# EasyEDA schematic Main Controller Design.json
TITLE: Main Controller; REV: 1.0; Date: 2019-12-06; Sheet: 1/1; Drawn By: mohitingale5; Company: SJSU
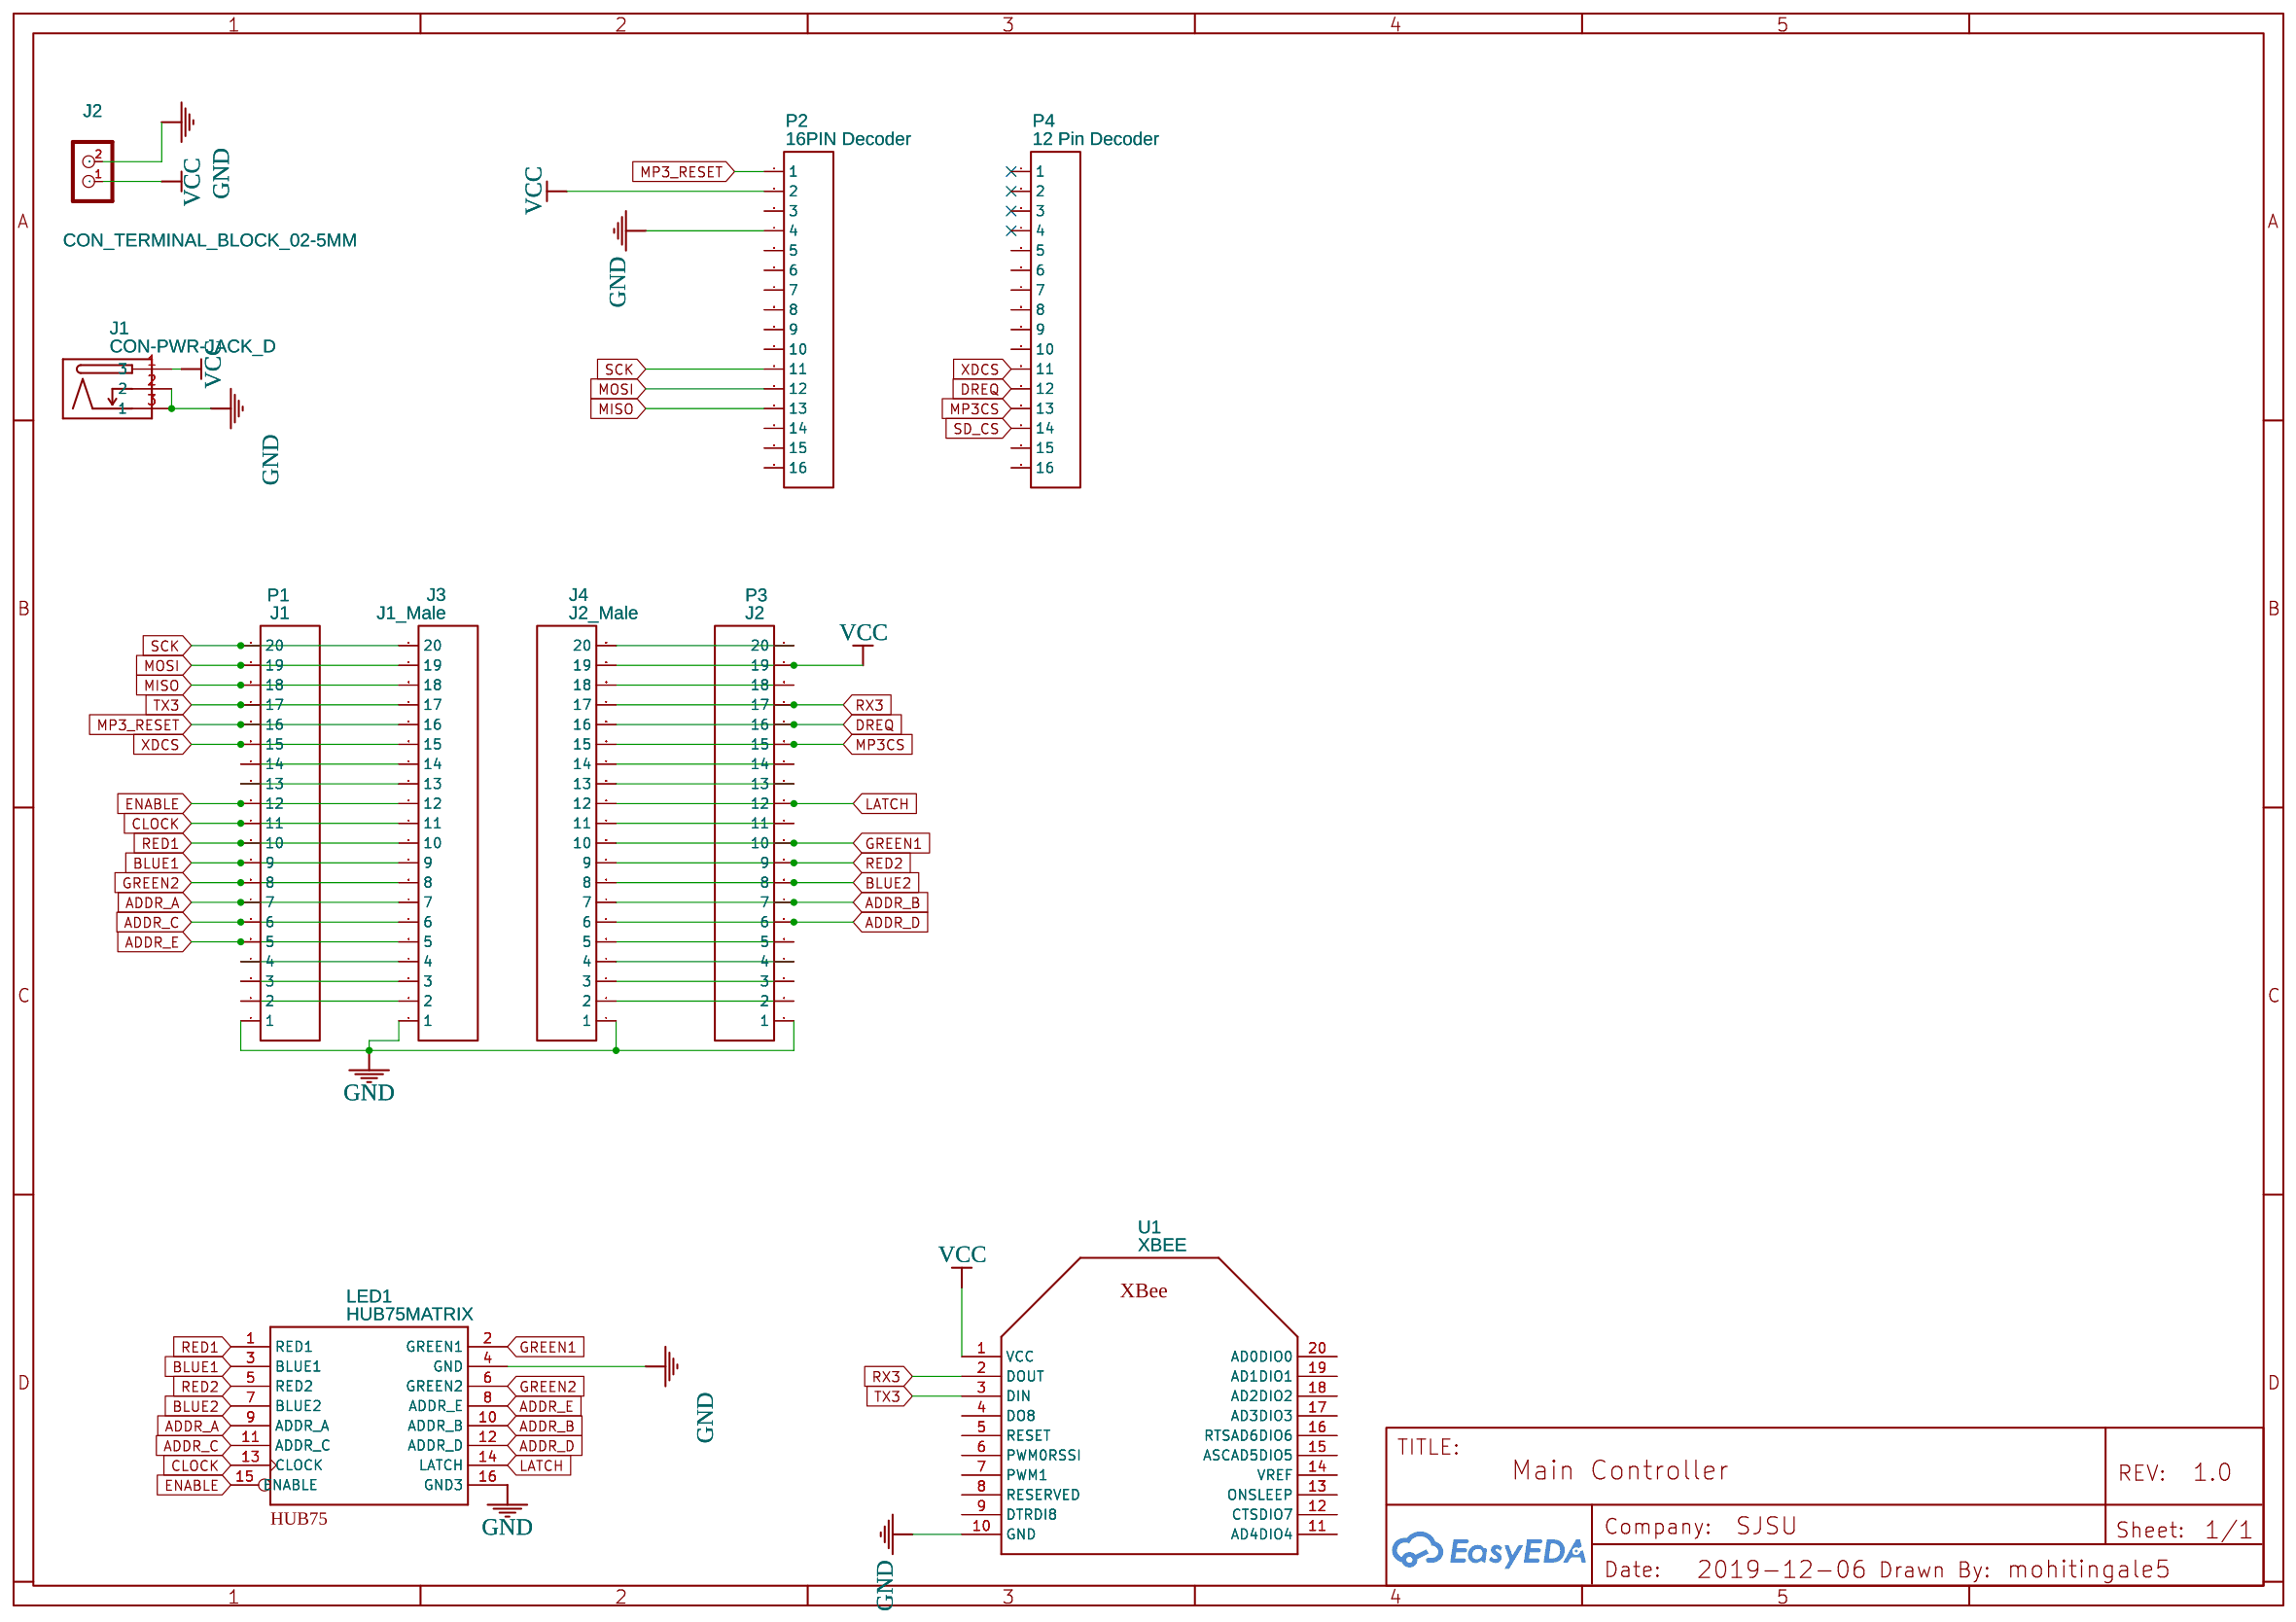
[diagram p0: schematic sheet]

## Parts
#1  -
J1  CON-PWR-JACK_D  [TDC-002-3]
J2  CON_TERMINAL_BLOCK_02-5MM  [TERMINAL_BLOCK_2P_5]
J3  J1_Male  [HDR-TH_20PIN-V-MALE-PITCH2.54]
J4  J2_Male  [HDR-TH_20PIN-V-MALE-PITCH2.54]
LED1  HUB75MATRIX  [2X08-IDC]
P1  J1  [HDR-TH_20P-P2.54-V]
P2  16PIN Decoder  [HDR-TH_16P-P2.54-V]
P3  J2  [HDR-TH_20P-P2.54-V]
P4  12 Pin Decoder  [HDR-TH_16P-P2.54-V]
U1  XBEE  [XBEE]

## Library data of the parts
#1 = -: BOM_Manufacturer Part: ?
J2 = -: 2 poles wire to board terminal block; Contributor: DangerousPrototype
J3 J4 = -: Supplier: LCSC; Manufacturer: BOOMELE; Manufacturer Part: 2.54mm 1*20PHeader; image: //image.lceda.cn/szlcsc/C50981.jpg; Supplier Part: C50981
LED1 U1 = -: Contributor: Adafruit
P1 P3 = -: Supplier: LCSC; Manufacturer: BOOMELE; Manufacturer Part: 2.54mm 1*20P Female header; Supplier Part: C50984
P2 P4 = -: Supplier: LCSC; Manufacturer: BOOMELE; Manufacturer Part: Female header1*16P pitch 2.54mm; image: //image.lceda.cn/szlcsc/C66987.jpg; Supplier Part: C66987

## Nets
GND: J1.2 J1.3(1) J2.2 J3.1 J4.1 LED1.4(GND) LED1.16(GND3) P1.1 P2.4 P3.1 U1.10(GND)
VCC: J1.1(3) J2.1 J4.19 P2.2 P3.19 U1.1(VCC)
ADDR_A: J3.7 LED1.9(ADDR_A) P1.7
ADDR_B: J4.7 LED1.10(ADDR_B) P3.7
ADDR_C: J3.6 LED1.11(ADDR_C) P1.6
ADDR_D: J4.6 LED1.12(ADDR_D) P3.6
ADDR_E: J3.5 LED1.8(ADDR_E) P1.5
BLUE1: J3.9 LED1.3(BLUE1) P1.9
BLUE2: J4.8 LED1.7(BLUE2) P3.8
CLOCK: J3.11 LED1.13(CLOCK) P1.11
DREQ: J4.16 P3.16 P4.12
ENABLE: J3.12 LED1.15(ENABLE) P1.12
GREEN1: J4.10 LED1.2(GREEN1) P3.10
GREEN2: J3.8 LED1.6(GREEN2) P1.8
LATCH: J4.12 LED1.14(LATCH) P3.12
MISO: J3.18 P1.18 P2.13
MOSI: J3.19 P1.19 P2.12
MP3_RESET: J3.16 P1.16 P2.1
MP3CS: J4.15 P3.15 P4.13
RED1: J3.10 LED1.1(RED1) P1.10
RED2: J4.9 LED1.5(RED2) P3.9
RX3: J4.17 P3.17 U1.2(DOUT)
SCK: J3.20 P1.20 P2.11
SD_CS: P4.14
TX3: J3.17 P1.17 U1.3(DIN)
XDCS: J3.15 P1.15 P4.11
Net-(J3-2): J3.2 P1.2
Net-(J3-3): J3.3 P1.3
Net-(J3-4): J3.4 P1.4
Net-(J3-13): J3.13 P1.13
Net-(J3-14): J3.14 P1.14
Net-(J4-2): J4.2 P3.2
Net-(J4-3): J4.3 P3.3
Net-(J4-4): J4.4 P3.4
Net-(J4-5): J4.5 P3.5
Net-(J4-11): J4.11 P3.11
Net-(J4-13): J4.13 P3.13
Net-(J4-14): J4.14 P3.14
Net-(J4-18): J4.18 P3.18
Net-(J4-20): J4.20 P3.20

Not connected (* = marked no-connect by the designer): P2 3 5 6 7 8 9 10 14 15 16; P4 1* 2* 3* 4* 5 6 7 8 9 10 15 16; U1 4(DO8) 5(RESET) 6(PWM0RSSI) 7(PWM1) 8(RESERVED) 9(DTRDI8) 11(AD4DIO4) 12(CTSDIO7) 13(ONSLEEP) 14(VREF) 15(ASCAD5DIO5) 16(RTSAD6DIO6) 17(AD3DIO3) 18(AD2DIO2) 19(AD1DIO1) 20(AD0DIO0)
